# EAGLE schematic drs (EAGLE 7.6.0)
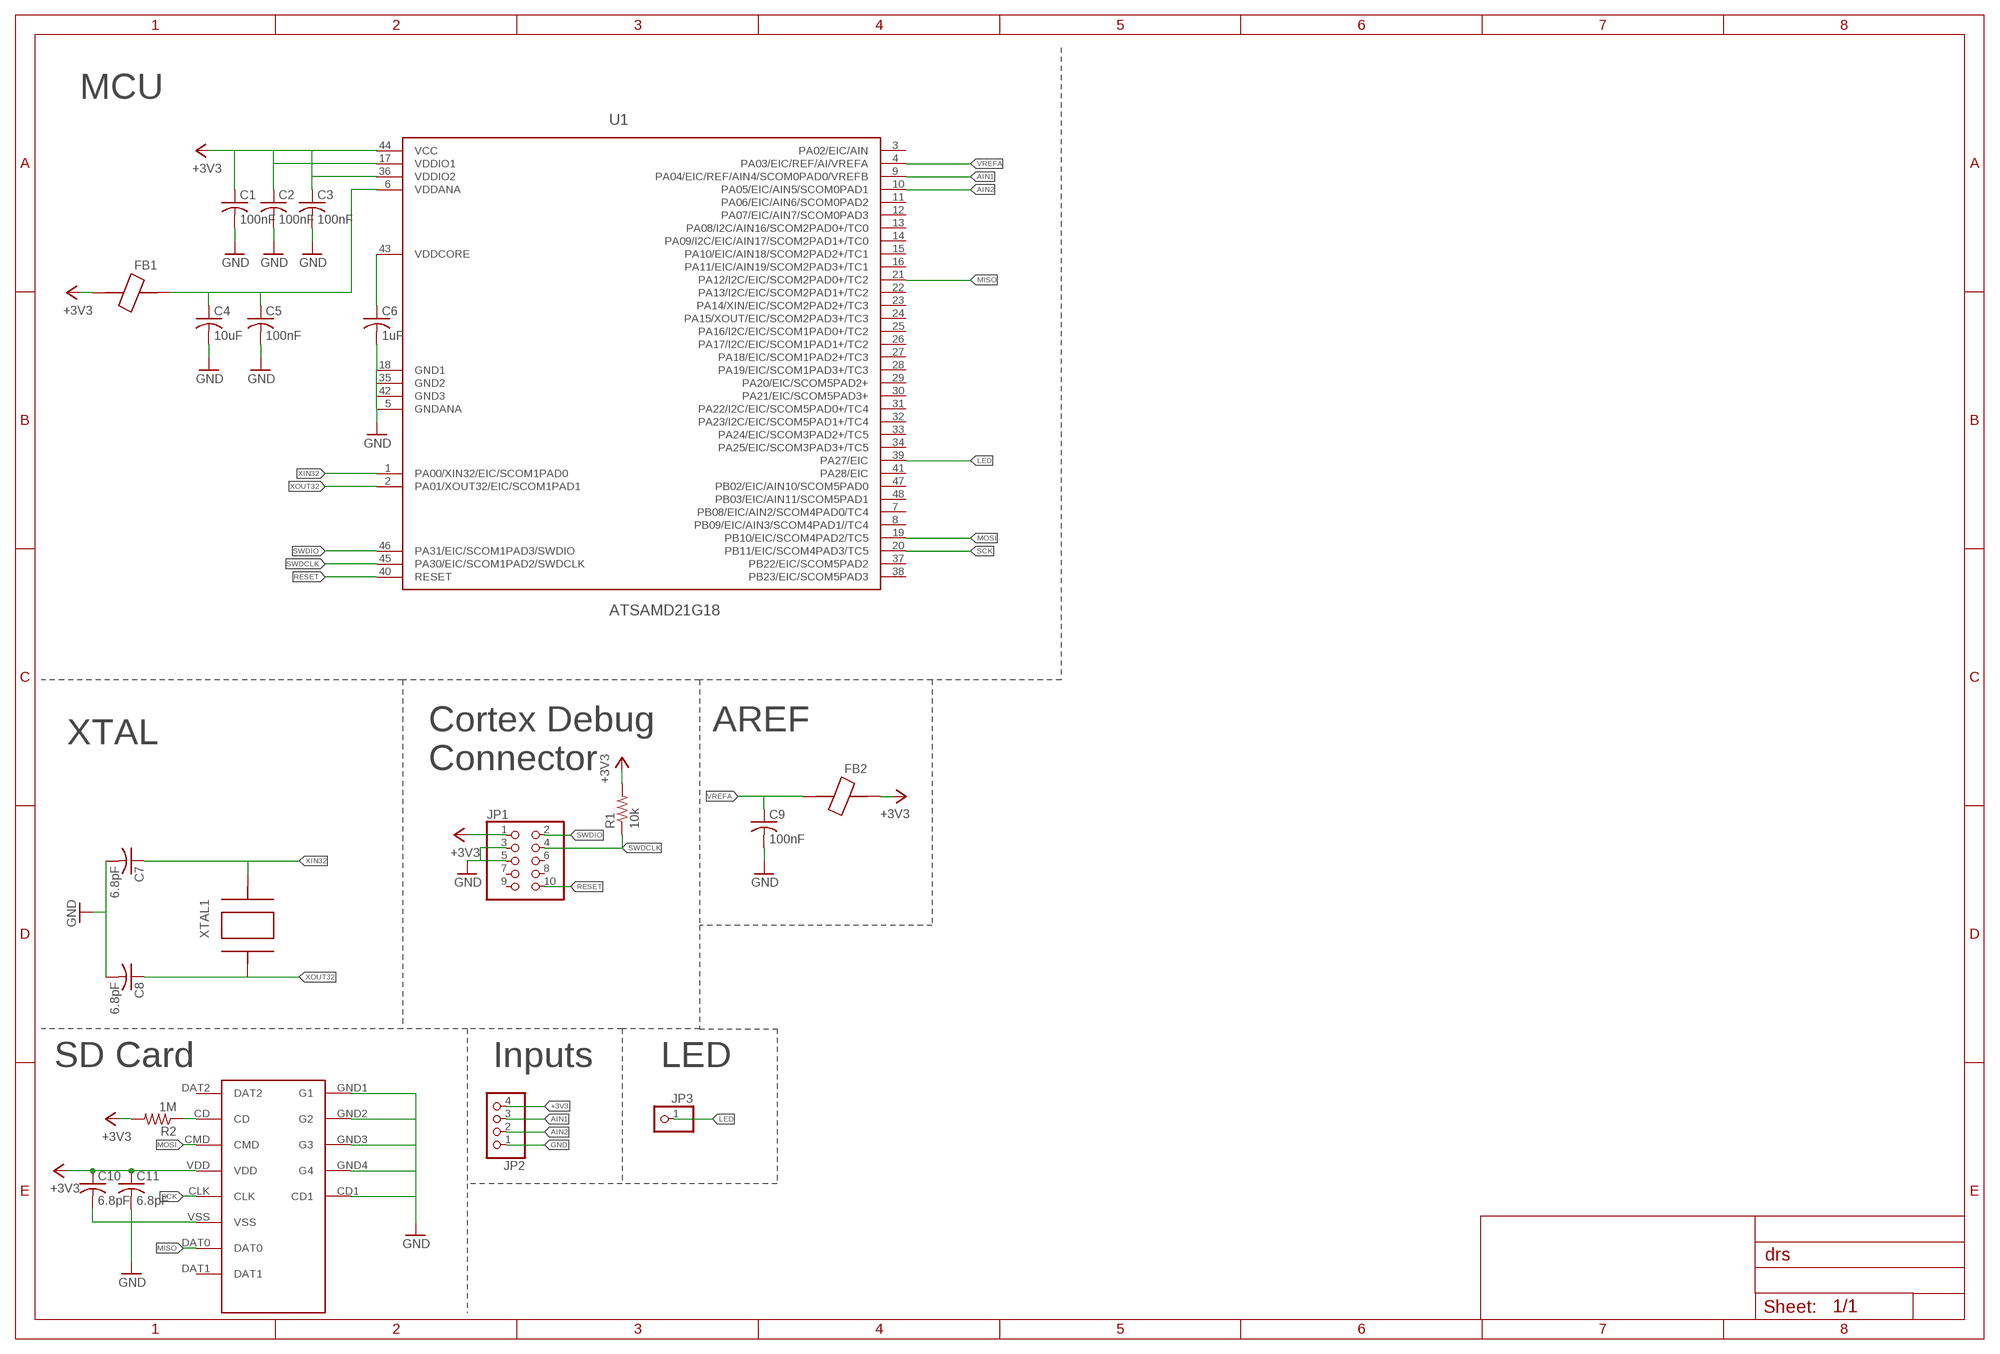
[diagram p0: schematic, sheet 1]

## Parts
C1  100nF  C-USC0603  [C0603]
C2  100nF  C-USC0603  [C0603]
C3  100nF  C-USC0603  [C0603]
C4  10uF  C-USC0603  [C0603]
C5  100nF  C-USC0603  [C0603]
C6  1uF  C-USC0603  [C0603]
C7  6.8pF  C-USC0603  [C0603]
C8  6.8pF  C-USC0603  [C0603]
C9  100nF  C-USC0603  [C0603]
C10  6.8pF  C-USC0603  [C0603]
C11  6.8pF  C-USC0603  [C0603]
FB1  FERRITE_BEAD-0603  [0603]
FB2  FERRITE_BEAD-0603  [0603]
JP1  PINHD-2X5  [2X05]
JP2  PINHD-1X4  [1X04]
JP3  PINHD-1X1  [1X01]
R1  10k  R-US_R0603  [R0603]
R2  1M  R-US_R0603  [R0603]
U1  ATSAMD21G18  [48-TQFP]
U$1  MICRO_SD  [MICRO_SD_HINGED]
XTAL1  ABS07AIG-32.768KHZ-1-T  [2-SMD]

## Nets
+3V3: C1.1 C2.1 C3.1 C10.1 C11.1 FB1.1 FB2.2 JP1.1 JP2.4 R1.2 R2.2 U1.17(VDDIO1) U1.36(VDDIO2) U1.44(VCC) U$1.VDD
AIN1: JP2.3 U1.9(PA04/EIC/REF/AIN4/SCOM0PAD0/VREFB)
AIN2: JP2.2 U1.10(PA05/EIC/AIN5/SCOM0PAD1)
GND: C1.2 C2.2 C3.2 C4.2 C5.2 C6.2 C7.2 C8.2 C9.2 C10.2 C11.2 JP1.5 JP2.1 U1.5(GNDANA) U1.18(GND1) U1.35(GND2) U1.42(GND3) U$1.CD1 U$1.GND1(G1) U$1.GND2(G2) U$1.GND3(G3) U$1.GND4(G4) U$1.VSS
LED: JP3.1 U1.39(PA27/EIC)
MISO: U1.21(PA12/I2C/EIC/SCOM2PAD0+/TC2) U$1.DAT0
MOSI: U1.19(PB10/EIC/SCOM4PAD2/TC5) U$1.CMD
N$1: R2.1 U$1.CD
N$2: JP1.3
N$4: C6.1 U1.43(VDDCORE)
N$5: C4.1 C5.1 FB1.2 U1.6(VDDANA)
RESET: JP1.10 U1.40(RESET)
SCK: U1.20(PB11/EIC/SCOM4PAD3/TC5) U$1.CLK
SWDCLK: JP1.4 R1.1 U1.45(PA30/EIC/SCOM1PAD2/SWDCLK)
SWDIO: JP1.2 U1.46(PA31/EIC/SCOM1PAD3/SWDIO)
VREFA: C9.1 FB2.1 U1.4(PA03/EIC/REF/AI/VREFA)
XIN32: C7.1 U1.1(PA00/XIN32/EIC/SCOM1PAD0) XTAL1.P2
XOUT32: C8.1 U1.2(PA01/XOUT32/EIC/SCOM1PAD1) XTAL1.P1
Unconnected: JP1.6 JP1.7 JP1.8 JP1.9 U1.3(PA02/EIC/AIN) U1.7(PB08/EIC/AIN2/SCOM4PAD0/TC4) U1.8(PB09/EIC/AIN3/SCOM4PAD1//TC4) U1.11(PA06/EIC/AIN6/SCOM0PAD2) U1.12(PA07/EIC/AIN7/SCOM0PAD3) U1.13(PA08/I2C/AIN16/SCOM2PAD0+/TC0) U1.14(PA09/I2C/EIC/AIN17/SCOM2PAD1+/TC0) U1.15(PA10/EIC/AIN18/SCOM2PAD2+/TC1) U1.16(PA11/EIC/AIN19/SCOM2PAD3+/TC1) U1.22(PA13/I2C/EIC/SCOM2PAD1+/TC2) U1.23(PA14/XIN/EIC/SCOM2PAD2+/TC3) U1.24(PA15/XOUT/EIC/SCOM2PAD3+/TC3) U1.25(PA16/I2C/EIC/SCOM1PAD0+/TC2) U1.26(PA17/I2C/EIC/SCOM1PAD1+/TC2) U1.27(PA18/EIC/SCOM1PAD2+/TC3) U1.28(PA19/EIC/SCOM1PAD3+/TC3) U1.29(PA20/EIC/SCOM5PAD2+) U1.30(PA21/EIC/SCOM5PAD3+) U1.31(PA22/I2C/EIC/SCOM5PAD0+/TC4) U1.32(PA23/I2C/EIC/SCOM5PAD1+/TC4) U1.33(PA24/EIC/SCOM3PAD2+/TC5) U1.34(PA25/EIC/SCOM3PAD3+/TC5) U1.37(PB22/EIC/SCOM5PAD2) U1.38(PB23/EIC/SCOM5PAD3) U1.41(PA28/EIC) U1.47(PB02/EIC/AIN10/SCOM5PAD0) U1.48(PB03/EIC/AIN11/SCOM5PAD1) U$1.DAT1 U$1.DAT2

## Notes on the sheet
- MCU
- Cortex Debug | AREF
- XTAL
- Connector
- SD Card | Inputs | LED

## Library data of the parts
C1-C11 = resistor:C-US: CAPACITOR, American symbol
FB1 FB2 = AR_passives:FERRITE_BEAD
JP1 = pinhead:PINHD-2X5: PIN HEADER
JP2 = pinhead:PINHD-1X4: PIN HEADER
JP3 = pinhead:PINHD-1X1: PIN HEADER
R1 R2 = resistor:R-US_: RESISTOR, American symbol
U1 = AR_mcu:ATSAMD21G18
U$1 = NR_connectors:MICRO_SD
XTAL1 = AR_XTAL:ABS07AIG-32.768KHZ-1-T